# EAGLE schematic gesamt (EAGLE 8.1.0)
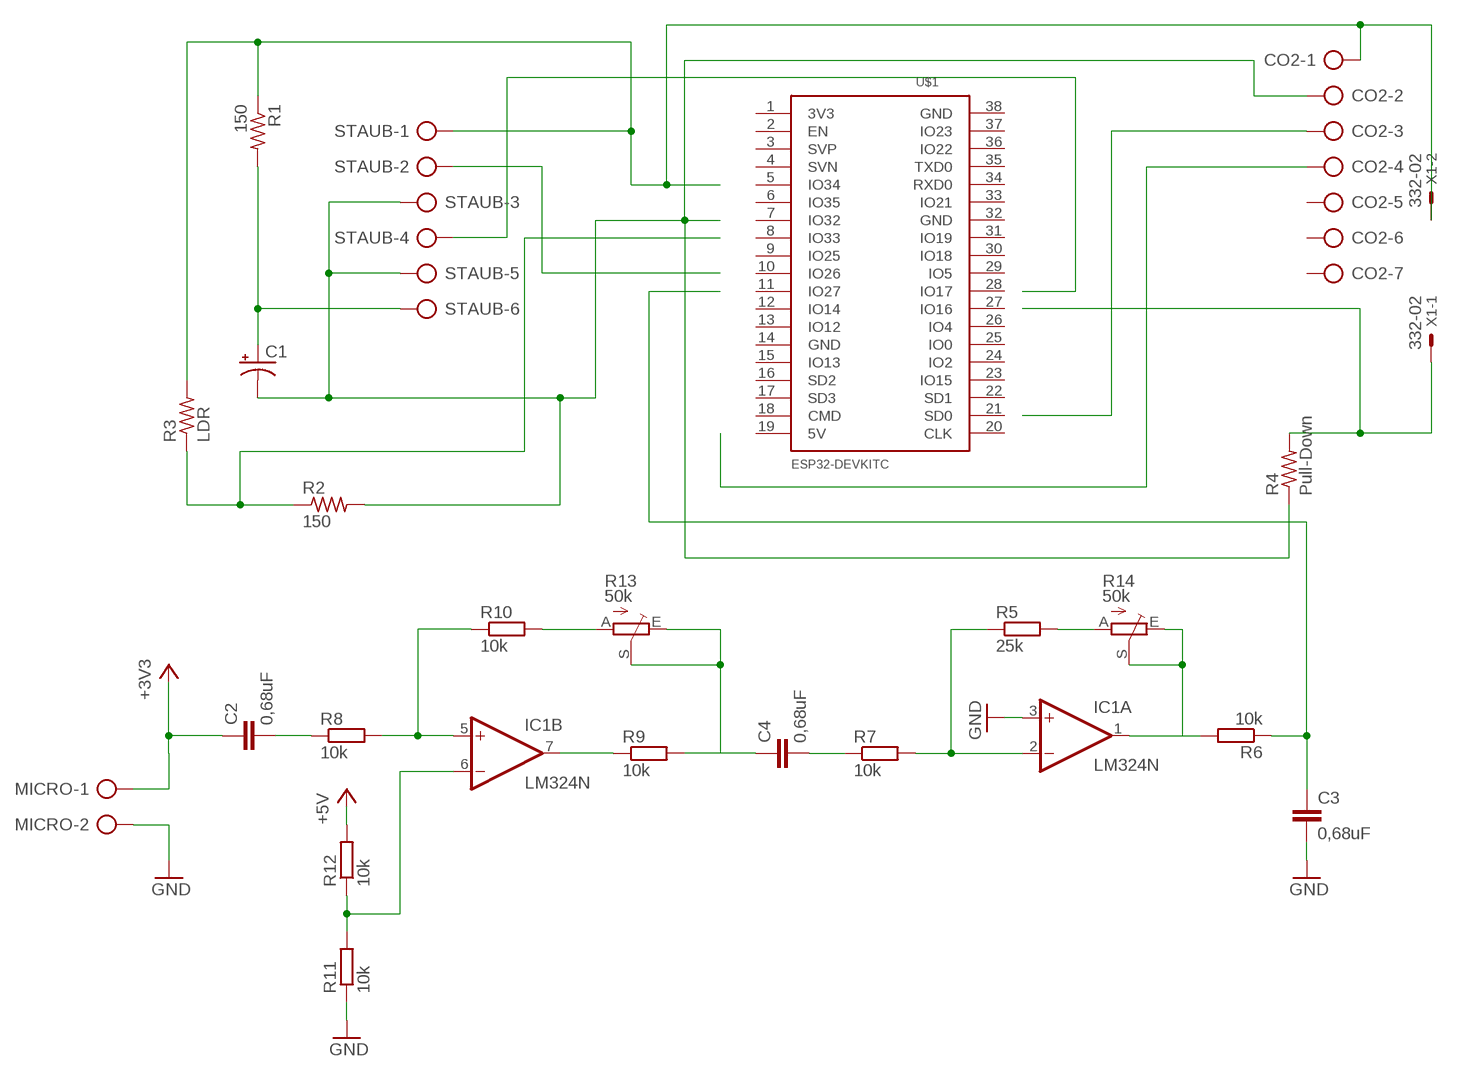
[diagram p0: schematic, sheet 1]

## Parts
C1  CPOL-USE2,5-6E  [E2,5-6E]
C2  0,68uF  C-EU025-025X050  [C025-025X050]
C3  0,68uF  C-EU025-025X050  [C025-025X050]
C4  0,68uF  C-EU025-025X050  [C025-025X050]
CO2  AK300/7  [AK300/7]
IC1  LM324N  [DIL14]
MICRO  AK300/2  [AK300/2]
R1  150  R-US_0207/10  [0207/10]
R2  150  R-US_0207/10  [0207/10]
R3  LDR  R-US_V234/12  [V234/12]
R4  Pull-Down  R-US_0207/10  [0207/10]
R5  25k  R-EU_0204/7  [0204/7]
R6  10k  R-EU_0204/7  [0204/7]
R7  10k  R-EU_0204/7  [0204/7]
R8  10k  R-EU_0204/7  [0204/7]
R9  10k  R-EU_0204/7  [0204/7]
R10  10k  R-EU_0204/7  [0204/7]
R11  10k  R-EU_0204/7  [0204/7]
R12  10k  R-EU_0204/7  [0204/7]
R13  50k  TRIM_EU-LI10  [LI10]
R14  50k  TRIM_EU-LI10  [LI10]
STAUB  AK300/6  [AK300/6]
U$1  ESP32DEVKITC  [ESP32-DEVKITC]
X1  332-02  [332-02]

## Nets
+3V3: C2.1 MICRO.1
+5V: R12.2
GND: C3.2 IC1.3(A:+IN) MICRO.2 R11.1
N$1: STAUB.2
N$2: C1.+ R1.2 STAUB.6
N$3: C1.- CO2.2 R2.2 R4.1 STAUB.3 STAUB.5
N$4: STAUB.4
N$5: CO2.3
N$6: CO2.4
N$7: R2.1 R3.1
N$8: R4.2 X1.1
N$9: CO2.1 R1.1 R3.2 STAUB.1 X1.2
N$10: C3.1 R6.1
N$11: R10.2 R13.A
N$12: C4.1 R9.2 R13.E R13.S
N$13: IC1.7(B:OUT) R9.1
N$14: IC1.5(B:+IN) R8.2 R10.1
N$15: C2.2 R8.1
N$16: IC1.6(B:-IN) R11.2 R12.1
N$17: C4.2 R7.1
N$18: IC1.2(A:-IN) R5.1 R7.2
N$19: IC1.1(A:OUT) R6.2 R14.E R14.S
N$20: R5.2 R14.A
Unconnected: CO2.5 CO2.6 CO2.7 IC1.8(C:OUT) IC1.9(C:-IN) IC1.10(C:+IN) IC1.12(D:+IN) IC1.13(D:-IN) IC1.14(D:OUT) U$1.1(3V3) U$1.2(EN) U$1.3(SVP) U$1.4(SVN) U$1.5(IO34) U$1.6(IO35) U$1.7(IO32) U$1.8(IO33) U$1.9(IO25) U$1.10(IO26) U$1.11(IO27) U$1.12(IO14) U$1.13(IO12) U$1.14(GND) U$1.15(IO13) U$1.16(SD2) U$1.17(SD3) U$1.18(CMD) U$1.19(5V) U$1.20(CLK) U$1.21(SD0) U$1.22(SD1) U$1.23(IO15) U$1.24(IO2) U$1.25(IO0) U$1.26(IO4) U$1.27(IO16) U$1.28(IO17) U$1.29(IO5) U$1.30(IO18) U$1.31(IO19) U$1.32(GND) U$1.33(IO21) U$1.34(RXD0) U$1.35(TXD0) U$1.36(IO22) U$1.37(IO23) U$1.38(GND)

## Power pins joined to a net without a drawn wire
V+: IC1.4(P:V+)
V-: IC1.11(P:V-)

## Library data of the parts
C1 = adafruit:CPOL-US: POLARIZED CAPACITOR, American symbol
C2-C4 = resistor:C-EU: CAPACITOR, European symbol
CO2 = con-ptr500:AK300/7: CONNECTOR; OC_FARNELL: unknown; OC_NEWARK: unknown
IC1 = linear:LM324: OP AMP
MICRO = con-ptr500:AK300/2: CONNECTOR; OC_FARNELL: unknown; OC_NEWARK: unknown
R1-R4 = adafruit:R-US_: RESISTOR, American symbol
R5-R12 = rcl:R-EU_: RESISTOR, European symbol
R13 R14 = pot:TRIM_EU-: POTENTIOMETER
STAUB = con-ptr500:AK300/6: CONNECTOR; OC_FARNELL: unknown; OC_NEWARK: unknown
U$1 = ESP32-DEVKITC_rightone:ESP32DEVKITC
X1 = con-garry:332-02: 2 Pin - 2mm Dual Row Source: www.mpe-connector.de / garry_shortform_2012.pdf